# Altium project Fan Controller.PrjPcb
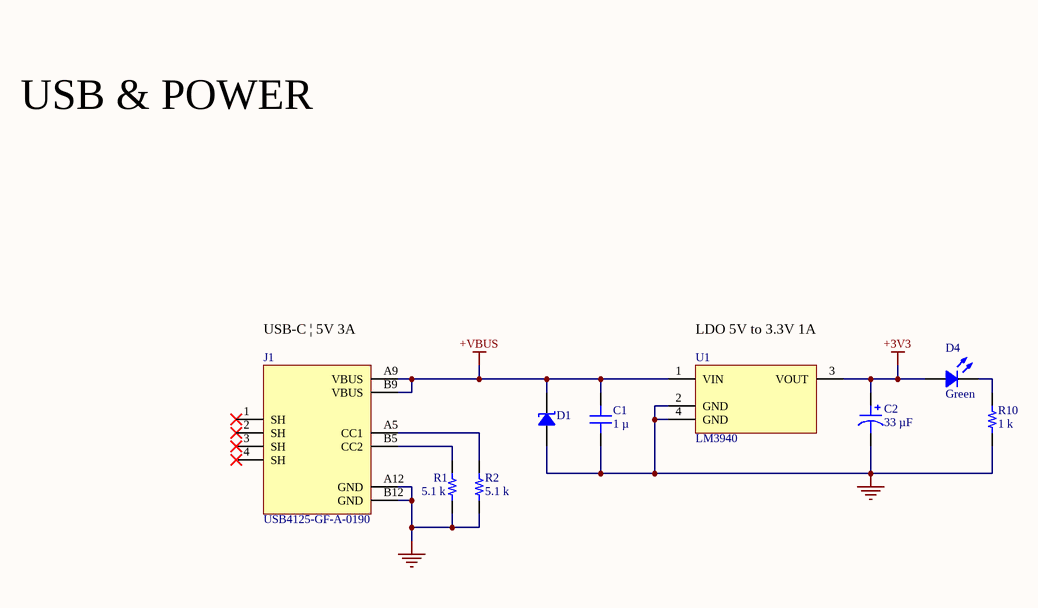
[diagram p0: USB.SchDoc]
3 sheets, 32 parts. Net scope: global (net labels, ports and power ports of the same name join across sheets).
Board file: CYCLONE.PcbDoc
Sheets:
  USB.SchDoc
  MCU.SchDoc
  PERIPHERALS.SchDoc

## Sheet USB.SchDoc
size 254 x 177 mm; SheetNumber: 1; SheetTotal: 3

### Parts
C1  1 µ  [CAP 0603_1608]
C2  33 µF  [CAP POL 1411_3528]
D1  VTVS5V0ASMF-M3-08  [SMF DO-219AB]  (value not drawn)
D4  Green  [LED 0603_1608 GREEN]
J1  USB4125-GF-A-0190  [FP-USB4125-GF-A-0190-MFG]
R1  5.1 k  [RES 0603_1608]
R2  5.1 k  [RES 0603_1608]
R10  1 k  [RES 0603_1608]
U1  LM3940  [FP-DCY0004A-IPC_C]

### Nets
+3V3: C2.1 D4.1 U1.3(VOUT)
+VBUS: C1.2 D1.2 J1.A9(VBUS) J1.B9(VBUS) U1.1(VIN)
GND: C1.1 C2.2 D1.1 J1.A12(GND) J1.B12(GND) R1.1 R2.1 R10.2 U1.2(GND) U1.4(GND)
NetD4_2: D4.2 R10.1
NetJ1_A5: J1.A5(CC1) R2.2
NetJ1_B5: J1.B5(CC2) R1.2

Not connected (* = marked no-connect by the designer): J1 1(SH)* 2(SH)* 3(SH)* 4(SH)*

### Notes on the sheet
- USB & POWER
- (near J1) USB-C | 5V 3A
- (near U1) LDO 5V to 3.3V 1A

### Library data of the parts
C1 = C0603C105K4RACAUTO: CAP CER 1UF 16V X7R 0603; manufacturer: KEMET; Capacitance: 1 µF; Tolerance: ±10%; Part Number: C0603C105K4RACAUTO; Value: 1 µ; Applications: Automotive, Bypass, Decoupling; componentlink1description: Datasheet; componentlink1url: https://api.kemet.com/component-edge/download/datasheet/C0603C105K4RACAUTO.pdf; componentlink2description: DigiKey Link; componentlink2url: https://www.digikey.com/en/products/detail/kemet/C0603C105K4RACAUTO/8635831; Device Package: 0603 (1608 Metric); lastupdated: 2/9/2024 8:10:30 PM; Lifecycle Status: Active; Minimum Order: 1; Mounting Type: Surface Mount, MLCC; Operating Temperature: -55°C ~ 125°C; Package / Case: 0603 (1608 Metric); packaging: TapeAndReel; partid: 2179; Part Status: Active; price: 0.01; Ratings: AEC-Q200; series: SMD Auto X7R; Size / Dimension: 0.063" L x 0.031" W (1.60mm x 0.80mm); Supplier 1: DigiKey; Supplier Part Number 1: 399-17704-1-ND; Temperature Coefficient: X7R; Thickness (Max): 0.037" (0.95mm); Voltage - Rated: 16V
C2 = T495B336M016ATE350: CAP TANT 33UF 20% 16V 1411; manufacturer: KEMET; Manufacturer Size Code: B; ESR (Equivalent Series Resistance): 350mOhm @ 100kHz; Lifetime @ Temp.: 2000 Hrs @ 125°C; Type: Molded; Part Number: T495B336M016ATE350; Value: 33 µF; Capacitance: 33 µF; componentlink1description: Datasheet; componentlink1url: https://api.kemet.com/component-edge/download/datasheet/T495B336M016ATE350.pdf; componentlink2description: DigiKey Link; componentlink2url: https://www.digikey.com/en/products/detail/kemet/T495B336M016ATE350/9642234; Device Package: 1411 (3528 Metric); Features: General Purpose; Height - Seated (Max): 0.083" (2.10mm); lastupdated: 3/11/2024 7:26:10 AM; Lifecycle Status: Active; Minimum Order: 1; Mounting Type: Surface Mount; Operating Temperature: -55°C ~ 125°C; Package / Case: 1411 (3528 Metric); packaging: TapeAndReel; partid: 33; Part Status: Active; price: 0.64; series: T495; Size / Dimension: 0.138" L x 0.110" W (3.50mm x 2.80mm); Supplier 1: DigiKey; Supplier Part Number 1: 399-18820-1-ND; Tolerance: ±20%; Voltage - Rated: 16 V
D1 = VTVS5V0ASMF-M3-08: TVS DIODE 5V 8.9V DO219AB; Manufacturer: Vishay Semiconductor Diodes Division; Capacitance @ Frequency: 2095pF @ 1MHz; Current - Peak Pulse (10/1000µs): 42.95A; Power Line Protection: No; Power - Peak Pulse: 400W; Type: Zener; Unidirectional Channels: 1; Voltage - Breakdown (Min): 6.4V; Part Number: VTVS5V0ASMF-M3-08; Applications: General Purpose; ComponentLink1Description: Datasheet; ComponentLink1URL: http://www.vishay.com/docs/85891/vtvs3v3asmf.pdf; ComponentLink2Description: DigiKey Link; ComponentLink2URL: http://digikey.com/product-detail/en/vishay-semiconductor-diodes-division/VTVS5V0ASMF-M3-08/VTVS5V0ASMF-M3-08GICT-ND/7056003; LastUpdated: 3/11/2024 8:09:28 AM; Lifecycle Status: Active; Minimum Order: 1; Mounting Type: Surface Mount; Operating Temperature: -55°C ~ 175°C (TJ); Package / Case: DO-219AB; Packaging: TapeAndReel; PartId: 5492; Part Status: Active; Price: 0.11; Series: TransZorb®; Supplier 1: DigiKey; Supplier Part Number 1: VTVS5V0ASMF-M3-08GICT-ND; Supplier Device Package: DO-219AB (SMF); Voltage - Clamping (Max) @ Ipp: 8.9V; Voltage - Reverse Standoff (Typ): 5V
D4 = SML-LXFP0603SUGCTR: LED GREEN CLEAR SMD; Manufacturer: Lumex Opto/Components Inc.; Configuration: Standard; Current - Test: 5mA; Lens Color: Colorless; Lens Size: 1.60mm x 0.80mm; Lens Style: Rectangle with Flat Top; Millicandela Rating: 13mcd; Viewing Angle: 130°; Voltage - Forward (Vf) (Typ): 2V; Wavelength - Peak: 574nm; Part Number: SML-LXFP0603SUGCTR; Color: Green; ComponentLink1Description: Datasheet; ComponentLink1URL: https://www.lumex.com/content/files/ProductAttachment/SML-LXFP0603SUGCTR.pdf; ComponentLink2Description: DigiKey Link; ComponentLink2URL: https://www.digikey.com/en/products/detail/lumex-opto-components-inc/SML-LXFP0603SUGCTR/4496766; Device Package: 0603 (1608 Metric); Height (Max): 0.20mm; LastUpdated: 3/11/2024 7:51:11 AM; Lens Transparency: Clear; Lifecycle Status: Active; Minimum Order: 1; Mounting Type: Surface Mount; Package / Case: 0603 (1608 Metric); Packaging: TapeAndReel; PartId: 589; Part Status: Active; Price: 0.07; Series: -; Size / Dimension: 1.60mm L x 0.80mm W; Supplier 1: DigiKey; Supplier Part Number 1: 67-2222-1-ND; Supplier Device Package: SMD; Value: Green
J1 = CMP-002-00081-2: USB-C (USB TYPE-C) Receptacle Connector 24 (6+18 Dummy) Position Surface Mount, Right Angle; Through Hole; Max Current Rating: 3A; Voltage Rating: 20V; Min Operating Temperature: -30°C; Pins: 24 (6+18 Dummy); Max Operating Temperature: 85°C; Gender: Receptacle; Connector Type: USB-C (USB TYPE-C); Manufacturer Part #: USB4125-GF-A; Mounting Technology: Surface Mount, Right Angle; Through Hole
R1 R2 = RMCF0603JG5K10: RES 5.1K OHM 5% 1/10W 0603; Manufacturer: Stackpole Electronics Inc; Power (Watts): 0.1W, 1/10W; Resistance: 5.1 kOhms; Temperature Coefficient: ±200ppm/°C; Part Number: RMCF0603JG5K10; Value: 5.1 k; ComponentLink1Description: Datasheet; ComponentLink1URL: https://www.seielect.com/catalog/sei-packaging.pdf; ComponentLink2Description: DigiKey Link; ComponentLink2URL: https://www.digikey.com/en/products/detail/stackpole-electronics-inc/RMCF0603JG5K10/1712287; Composition: Thick Film; Device Package: 0603 (1608 Metric); Features: Automotive AEC-Q200; Height - Seated (Max): 0.022" (0.55mm); LastUpdated: 2/9/2024 8:43:35 PM; Lifecycle Status: Active; Minimum Order: 1; Number of Terminations: 2; Operating Temperature: -55°C ~ 155°C; Package / Case: 0603 (1608 Metric); Packaging: CutTape; PartId: 5180; Part Status: Active; Price: 0.01; Ratings: AEC-Q200; Series: RMCF; Size / Dimension: 0.061" L x 0.031" W (1.55mm x 0.80mm); Supplier 1: DigiKey; Supplier Part Number 1: 738-RMCF0603JG5K10CT-ND; Supplier Device Package: 0603; Tolerance: ±5%
R10 = CPF0603B1K0E: RES SMD 1K OHM 0.1% 1/16W 0603; Manufacturer: TE Connectivity Passive Product; Power (Watts): 0.063W, 1/16W; Resistance: 1 kOhms; Temperature Coefficient: ±25ppm/°C; Part Number: CPF0603B1K0E; Value: 1 k; ComponentLink1Description: Datasheet; ComponentLink1URL: https://www.te.com/commerce/DocumentDelivery/DDEController?Action=srchrtrv&DocNm=1773200&DocType=DS&DocLang=English; ComponentLink2Description: DigiKey Link; ComponentLink2URL: https://www.digikey.com/en/products/detail/te-connectivity-passive-product/CPF0603B1K0E/2390473; Composition: Thin Film; Device Package: 0603 (1608 Metric); Height - Seated (Max): 0.022" (0.55mm); LastUpdated: 2/9/2024 8:43:37 PM; Lifecycle Status: Active; Minimum Order: 1; Number of Terminations: 2; Operating Temperature: -55°C ~ 155°C; Package / Case: 0603 (1608 Metric); Packaging: TapeAndReel; PartId: 4877; Part Status: Active; Price: 0.09; Series: CPF, Neohm; Size / Dimension: 0.061" L x 0.031" W (1.55mm x 0.80mm); Supplier 1: DigiKey; Supplier Part Number 1: A119887CT-ND; Supplier Device Package: 0603; Tolerance: ±0.1%
U1 = CMP-019-00049-4: IC REG LDO 3.3V 1A SOT223

## Sheet MCU.SchDoc
size 254 x 177 mm; SheetNumber: 2; SheetTotal: 3
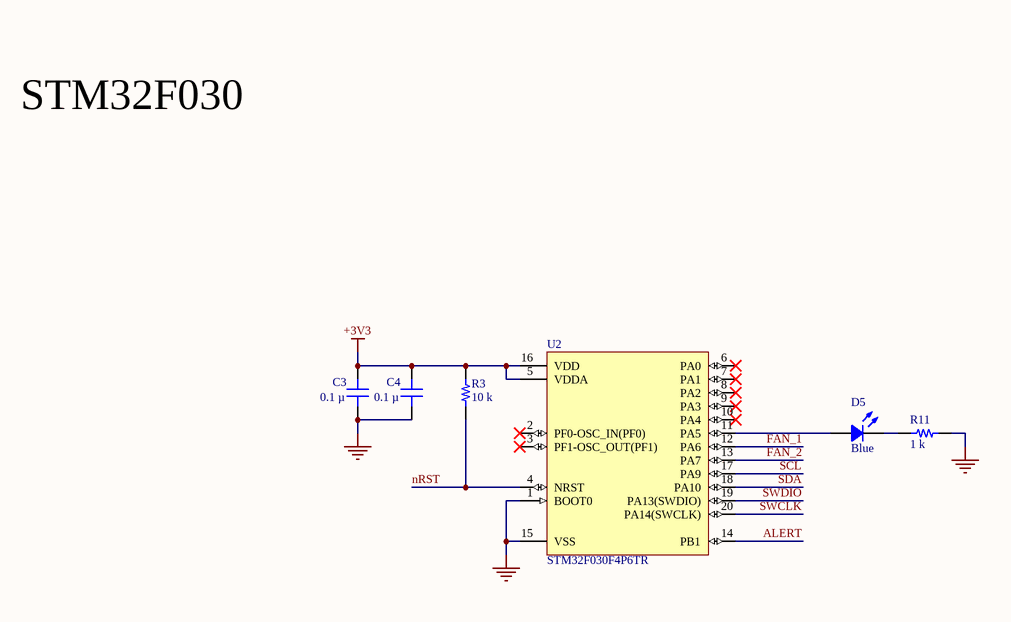
[diagram p1: MCU.SchDoc]

### Parts
C3  0.1 µ  [CAP 0603_1608]
C4  0.1 µ  [CAP 0603_1608]
D5  Blue  [LED 0603_1608 BLUE]
R3  10 k  [RES 0603_1608]
R11  1 k  [RES 0603_1608]
U2  STM32F030F4P6TR  [STM-TSSOP20_M]

### Nets
+3V3: C3.2 C4.2 R3.2 U2.5(VDDA) U2.16(VDD)
GND: C3.1 C4.1 R11.2 U2.1(BOOT0) U2.15(VSS)
ALERT: U2.14(PB1)
FAN_1: U2.12(PA6)
FAN_2: U2.13(PA7)
nRST: R3.1 U2.4(NRST)
SCL: U2.17(PA9)
SDA: U2.18(PA10)
SWCLK: U2.20(PA14(SWCLK))
SWDIO: U2.19(PA13(SWDIO))
NetD5_1: D5.1 U2.11(PA5)
NetD5_2: D5.2 R11.1

Not connected (* = marked no-connect by the designer): U2 2(PF0-OSC_IN(PF0))* 3(PF1-OSC_OUT(PF1))* 6(PA0)* 7(PA1)* 8(PA2)* 9(PA3)* 10(PA4)*

### Notes on the sheet
- STM32F030

### Library data of the parts
C3 C4 = C0603C104K5RAC7411: CAP CER 0.1UF 50V X7R 0603; manufacturer: KEMET; Capacitance: 0.1 µF; Tolerance: ±10%; Part Number: C0603C104K5RAC7411; Value: 0.1 µ; Applications: Bypass, Decoupling; componentlink1description: Datasheet; componentlink1url: https://api.kemet.com/component-edge/download/datasheet/C0603C104K5RAC7411.pdf; componentlink2description: DigiKey Link; componentlink2url: https://www.digikey.com/en/products/detail/kemet/C0603C104K5RAC7411/3317013; Device Package: 0603 (1608 Metric); lastupdated: 2/9/2024 8:10:30 PM; Lifecycle Status: Active; Minimum Order: 1; Mounting Type: Surface Mount, MLCC; Operating Temperature: -55°C ~ 125°C; Package / Case: 0603 (1608 Metric); packaging: TapeAndReel; partid: 2233; Part Status: Active; price: 0.01; series: SMD Comm X7R; Size / Dimension: 0.063" L x 0.031" W (1.60mm x 0.80mm); Supplier 1: DigiKey; Supplier Part Number 1: 399-C0603C104K5RAC7411CT-ND; Temperature Coefficient: X7R; Thickness (Max): 0.035" (0.90mm); Voltage - Rated: 50V
D5 = LTST-C190TBKT: LED BLUE CLEAR CHIP SMD; Manufacturer: Lite-On Inc.; Configuration: Standard; Current - Test: 20mA; Lens Color: Colorless; Lens Size: 1.10mm x 0.80mm; Lens Style: Rectangle with Flat Top; Millicandela Rating: 104mcd; Viewing Angle: 130°; Voltage - Forward (Vf) (Typ): 3.3V; Wavelength - Dominant: 470nm; Wavelength - Peak: 468nm; Part Number: LTST-C190TBKT; Color: Blue; ComponentLink1Description: Datasheet; ComponentLink1URL: http://optoelectronics.liteon.com/upload/download/DS-22-99-0224/LTST-C190TBKT.PDF; ComponentLink2Description: DigiKey Link; ComponentLink2URL: http://digikey.com/product-detail/en/lite-on-inc/LTST-C190TBKT/160-1646-1-ND/573586; Device Package: 0603 (1608 Metric); Height (Max): 0.90mm; LastUpdated: 3/11/2024 7:50:10 AM; Lens Transparency: Clear; Lifecycle Status: Active; Minimum Order: 1; Mounting Type: Surface Mount; Package / Case: 0603 (1608 Metric); Packaging: TapeAndReel; PartId: 831; Part Status: Active; Price: 0.08; Series: -; Size / Dimension: 1.60mm L x 0.80mm W; Supplier 1: DigiKey; Supplier Part Number 1: 160-1646-1-ND; Supplier Device Package: Chip LED; Value: Blue
R3 = RNCS0603BKE10K0: RES 10K OHM 0.1% 1/16W 0603; Manufacturer: Stackpole Electronics Inc; Power (Watts): 0.063W, 1/16W; Resistance: 10 kOhms; Temperature Coefficient: ±25ppm/°C; Part Number: RNCS0603BKE10K0; Value: 10 k; ComponentLink1Description: Datasheet; ComponentLink1URL: https://www.seielect.com/catalog/sei-rncs_rnch.pdf; ComponentLink2Description: DigiKey Link; ComponentLink2URL: https://www.digikey.com/en/products/detail/stackpole-electronics-inc/RNCS0603BKE10K0/1708836; Composition: Thin Film; Device Package: 0603 (1608 Metric); Features: Anti-Corrosive, Automotive AEC-Q200, Moisture Resistant; Height - Seated (Max): 0.022" (0.55mm); LastUpdated: 2/9/2024 8:43:37 PM; Lifecycle Status: Active; Minimum Order: 1; Number of Terminations: 2; Operating Temperature: -55°C ~ 155°C; Package / Case: 0603 (1608 Metric); Packaging: TapeAndReel; PartId: 4838; Part Status: Active; Price: 0.06; Ratings: AEC-Q200; Series: RNCS; Size / Dimension: 0.061" L x 0.031" W (1.55mm x 0.80mm); Supplier 1: DigiKey; Supplier Part Number 1: RNCS0603BKE10K0CT-ND; Supplier Device Package: 0603; Tolerance: ±0.1%
R11 = CPF0603B1K0E: as R10 on sheet USB; Part Number: CPF0603B1K0E; Value: 1 k; ComponentLink1Description: Datasheet; ComponentLink1URL: https://www.te.com/commerce/DocumentDelivery/DDEController?Action=srchrtrv&DocNm=1773200&DocType=DS&DocLang=English; ComponentLink2Description: DigiKey Link; ComponentLink2URL: https://www.digikey.com/en/products/detail/te-connectivity-passive-product/CPF0603B1K0E/2390473; Composition: Thin Film; Device Package: 0603 (1608 Metric); Height - Seated (Max): 0.022" (0.55mm); LastUpdated: 2/9/2024 8:43:37 PM; Lifecycle Status: Active; Minimum Order: 1; Number of Terminations: 2; Operating Temperature: -55°C ~ 155°C; Package / Case: 0603 (1608 Metric); Packaging: TapeAndReel; PartId: 4877; Part Status: Active; Price: 0.09; Series: CPF, Neohm; Size / Dimension: 0.061" L x 0.031" W (1.55mm x 0.80mm); Supplier 1: DigiKey; Supplier Part Number 1: A119887CT-ND; Supplier Device Package: 0603; Tolerance: ±0.1%
U2 = CMP-031-00009-3: RISC Microcontroller, 32-Bit, FLASH, CORTEX-M0 CPU, 48MHz, CMOS, PDSO20; Min Supply Voltage: 2.4V; Max Supply Voltage: 3.6V; Case/Package: TSSOP; Min Operating Temperature: -40°C; Pins: 20; RoHS Compliant: Yes; Max Operating Temperature: 85°C

## Sheet PERIPHERALS.SchDoc: dfl
size 254 x 177 mm; SheetNumber: 3; SheetTotal: 3
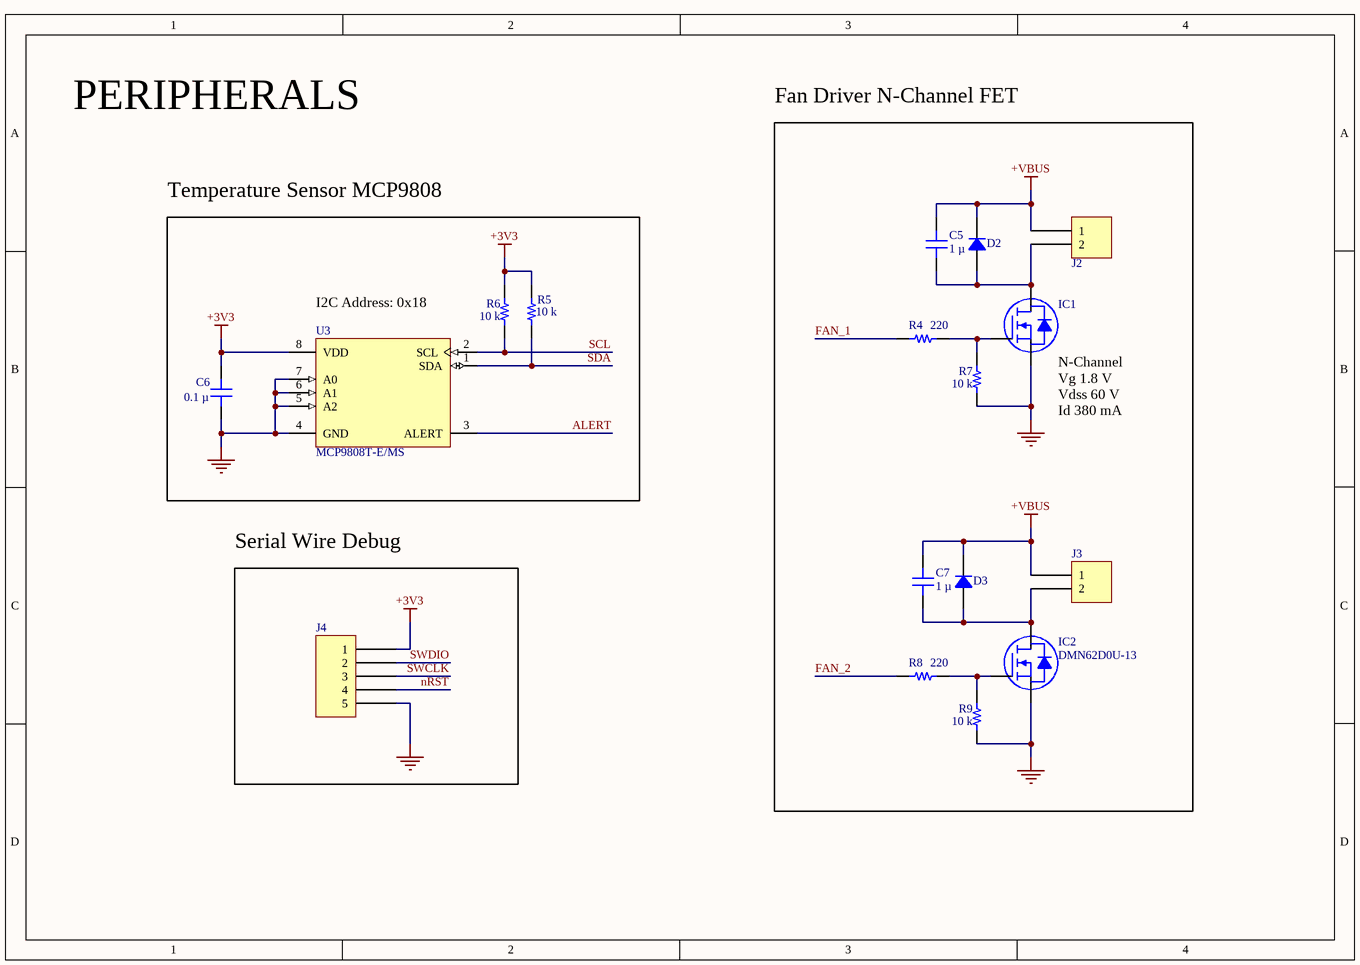
[diagram p2: PERIPHERALS.SchDoc]

### Parts
C5  1 µ  [CAP 0603_1608]
C6  0.1 µ  [CAP 0603_1608]
C7  1 µ  [CAP 0603_1608]
D2  US1DWF-7  [SOD123F]  (value not drawn)
D3  US1DWF-7  [SOD123F]  (value not drawn)
IC1  DMN62D0U-13  [DIODES SOT-23-3]  (value not drawn)
IC2  DMN62D0U-13  [DIODES SOT-23-3]
J2  S2B-PH-SM4-TB(LF)(SN)  [JST S2B-PH-SM4-TB]  (value not drawn)
J3  S2B-PH-SM4-TB(LF)(SN)  [JST S2B-PH-SM4-TB]  (value not drawn)
J4  NPPN051BFCN-RC  [SULLINS NPPN051BFCN]  (value not drawn)
R4  220  [RES 0603_1608]
R5  10 k  [RES 0603_1608]
R6  10 k  [RES 0603_1608]
R7  10 k  [RES 0603_1608]
R8  220  [RES 0603_1608]
R9  10 k  [RES 0603_1608]
U3  MCP9808T-E/MS  [FP-C04-111-MFG]

### Blocks framed on the sheet
Fan Driver N-Channel FET: C5 C7 D2 D3 IC1 IC2 J2 J3 R4 R7-R9
Temperature Sensor MCP9808: C6 R5 R6 U3
Serial Wire Debug: J4

### Nets
+3V3: C6.2 J4.1 R5.2 R6.2 U3.8(VDD)
+VBUS: C5.2 C7.2 D2.2 D3.2 J2.1 J3.1
GND: C6.1 IC1.2(S) IC2.2(S) J4.5 R7.1 R9.1 U3.4(GND) U3.5(A2) U3.6(A1) U3.7(A0)
ALERT: U3.3(ALERT)
FAN_1: R4.1
FAN_2: R8.1
nRST: J4.4
SCL: R6.1 U3.2(SCL)
SDA: R5.1 U3.1(SDA)
SWCLK: J4.3
SWDIO: J4.2
NetC5_1: C5.1 D2.1 IC1.3(D) J2.2
NetC7_1: C7.1 D3.1 IC2.3(D) J3.2
NetIC1_1: IC1.1(G) R4.2 R7.2
NetIC2_1: IC2.1(G) R8.2 R9.2

### Notes on the sheet
- PERIPHERALS
- (near U3) I2C Address: 0x18
- (near IC1) N-Channel
  Vg 1.8 V
  Vdss 60 V
  Id 380 mA

### Library data of the parts
C5 C7 = C0603C105K4RACAUTO: as C1 on sheet USB; Part Number: C0603C105K4RACAUTO; Value: 1 µ; Applications: Automotive, Bypass, Decoupling; componentlink1description: Datasheet; componentlink1url: https://api.kemet.com/component-edge/download/datasheet/C0603C105K4RACAUTO.pdf; componentlink2description: DigiKey Link; componentlink2url: https://www.digikey.com/en/products/detail/kemet/C0603C105K4RACAUTO/8635831; Device Package: 0603 (1608 Metric); lastupdated: 2/9/2024 8:10:30 PM; Lifecycle Status: Active; Minimum Order: 1; Mounting Type: Surface Mount, MLCC; Operating Temperature: -55°C ~ 125°C; Package / Case: 0603 (1608 Metric); packaging: TapeAndReel; partid: 2179; Part Status: Active; price: 0.01; Ratings: AEC-Q200; series: SMD Auto X7R; Size / Dimension: 0.063" L x 0.031" W (1.60mm x 0.80mm); Supplier 1: DigiKey; Supplier Part Number 1: 399-17704-1-ND; Temperature Coefficient: X7R; Thickness (Max): 0.037" (0.95mm); Voltage - Rated: 16V
C6 = C0603C104K5RAC7411: as C3 on sheet MCU; Part Number: C0603C104K5RAC7411; Value: 0.1 µ; Applications: Bypass, Decoupling; componentlink1description: Datasheet; componentlink1url: https://api.kemet.com/component-edge/download/datasheet/C0603C104K5RAC7411.pdf; componentlink2description: DigiKey Link; componentlink2url: https://www.digikey.com/en/products/detail/kemet/C0603C104K5RAC7411/3317013; Device Package: 0603 (1608 Metric); lastupdated: 2/9/2024 8:10:30 PM; Lifecycle Status: Active; Minimum Order: 1; Mounting Type: Surface Mount, MLCC; Operating Temperature: -55°C ~ 125°C; Package / Case: 0603 (1608 Metric); packaging: TapeAndReel; partid: 2233; Part Status: Active; price: 0.01; series: SMD Comm X7R; Size / Dimension: 0.063" L x 0.031" W (1.60mm x 0.80mm); Supplier 1: DigiKey; Supplier Part Number 1: 399-C0603C104K5RAC7411CT-ND; Temperature Coefficient: X7R; Thickness (Max): 0.035" (0.90mm); Voltage - Rated: 50V
D2 D3 = US1DWF-7: DIODE GEN PURP 200V 1A SOD123F; Manufacturer: Diodes Incorporated; Capacitance @ Vr, F: 14pF @ 4V, 1MHz; Current - Reverse Leakage @ Vr: 5 µA @ 200 V; Diode Type: Standard; Reverse Recovery Time (trr): 35 ns; Speed: Fast Recovery =< 500ns, > 200mA (Io); Voltage - Forward (Vf) (Max) @ If: 950 mV @ 1 A; Part Number: US1DWF-7; ComponentLink1Description: Datasheet; ComponentLink1URL: https://www.diodes.com/assets/Datasheets/US1DWF.pdf; ComponentLink2Description: DigiKey Link; ComponentLink2URL: https://www.digikey.com/en/products/detail/diodes-incorporated/US1DWF-7/7422876; Current - Average Rectified (Io): 1A; LastUpdated: 3/11/2024 7:46:45 AM; Lifecycle Status: Active; Minimum Order: 1; Mounting Type: Surface Mount; Operating Temperature - Junction: -55°C ~ 150°C; Package / Case: SOD-123F; Packaging: TapeAndReel; PartId: 1114; Part Status: Active; Price: 0.10; Series: -; Supplier 1: DigiKey; Supplier Part Number 1: US1DWF-7DICT-ND; Supplier Device Package: SOD-123F; Voltage - DC Reverse (Vr) (Max): 200 V
IC1 IC2 = DMN62D0U-13: MOSFET N-CH 60V 380MA SOT23; Manufacturer: Diodes Incorporated; Current - Continuous Drain (Id) @ 25°C: 380mA (Ta); Drive Voltage (Max Rds On,  Min Rds On): 1.8V, 4.5V; FET Type: N-Channel; Gate Charge (Qg) (Max) @ Vgs: 0.5 nC @ 4.5 V; Input Capacitance (Ciss) (Max) @ Vds: 32 pF @ 30 V; Power Dissipation (Max): 380mW (Ta); Rds On (Max) @ Id, Vgs: 2Ohm @ 100mA, 4.5V; Vgs (Max): ±20V; Vgs(th) (Max) @ Id: 1V @ 250µA; Part Number: DMN62D0U-13; ComponentLink1Description: Datasheet; ComponentLink1URL: https://www.diodes.com/assets/Datasheets/DMN62D0U.pdf; ComponentLink2Description: DigiKey Link; ComponentLink2URL: https://www.digikey.com/en/products/detail/diodes-incorporated/DMN62D0U-13/5453123; Drain to Source Voltage (Vdss): 60 V; LastUpdated: 3/11/2024 8:04:06 AM; Lifecycle Status: Active; Minimum Order: 1; Mounting Type: Surface Mount; Operating Temperature: -55°C ~ 150°C (TJ); Package / Case: TO-236-3, SC-59, SOT-23-3; Packaging: TapeAndReel; Part Status: Active; Price: 0.03; Series: -; Supplier 1: DigiKey; Supplier Part Number 1: DMN62D0U-13DICT-ND; Supplier Device Package: SOT-23-3; Technology: MOSFET (Metal Oxide)
J2 J3 = S2B-PH-SM4-TB(LF)(SN): CONN HEADER SMD R/A 2POS 2MM; Manufacturer: JST Sales America Inc.; Contact Length - Mating: 0.130" (3.30mm); Current Rating (Amps): 2A; Material Flammability Rating: UL94 V-0; Number of Positions: 2; Number of Positions Loaded: All; Pitch - Mating: 0.079" (2.00mm); Shrouding: Shrouded - 4 Wall; Style: Board to Cable/Wire; Voltage Rating: 100V; Part Number: S2B-PH-SM4-TB(LF)(SN); ComponentLink1Description: Datasheet; ComponentLink1URL: http://www.jst-mfg.com/product/pdf/eng/ePH.pdf; ComponentLink2Description: DigiKey Link; ComponentLink2URL: http://digikey.com/product-detail/en/jst-sales-america-inc/S2B-PH-SM4-TB-LF-SN/455-1749-1-ND/926846; Connector Type: Header; Contact Finish - Mating: Tin; Contact Finish - Post: Tin; Contact Material: Copper Alloy; Contact Shape: Square; Contact Type: Male Pin; Fastening Type: Detent Lock; Features: Solder Retention; Insulation Color: Natural; Insulation Height: 0.217" (5.51mm); Insulation Material: Polyamide (PA6T), Nylon 6T; LastUpdated: 1/15/2020 3:45:11 AM; Lifecycle Status: Active; Minimum Order: 1; Mounting Type: Surface Mount, Right Angle; Number of Rows: 1; Operating Temperature: -25°C ~ 85°C; Packaging: TapeAndReel; PartId: 115; Part Status: Active; Price: 0.27; Series: PH; Supplier 1: DigiKey; Supplier Part Number 1: 455-1749-1-ND; Termination: Solder
J4 = NPPN051BFCN-RC: CONN HDR 5POS 0.079 GOLD PCB; Manufacturer: Sullins Connector Solutions; Connector Type: Header; Contact Length - Post: 0.094" (2.40mm); Current Rating (Amps): 2A; Material Flammability Rating: UL94 V-0; Number of Positions: 5; Number of Positions Loaded: All; Pitch - Mating: 0.079" (2.00mm); Style: Board to Board; Part Number: NPPN051BFCN-RC; ComponentLink1Description: Datasheet; ComponentLink1URL: https://drawings-pdf.s3.amazonaws.com/10483.pdf; ComponentLink2Description: DigiKey Link; ComponentLink2URL: https://www.digikey.com/en/products/detail/sullins-connector-solutions/NPPN051BFCN-RC/804807; Contact Finish - Mating: Gold; Contact Finish - Post: Gold; Contact Finish Thickness - Mating: Flash; Contact Type: Female Socket; Fastening Type: Push-Pull; Insulation Color: Black; Insulation Height: 0.173" (4.40mm); LastUpdated: 6/21/2022 2:43:08 PM; Lifecycle Status: Active; Minimum Order: 1; Mounting Type: Through Hole; Number of Rows: 1; Operating Temperature: -40°C ~ 105°C; Packaging: Tube; Part Status: Active; Price: 0.35; Series: -; Supplier 1: DigiKey; Supplier Part Number 1: S5751-05-ND; Termination: Solder
R4 R8 = ERA-3AED221V: RES SMD 220 OHM 0.5% 1/10W 0603; Manufacturer: Panasonic Electronic Components; Power (Watts): 0.1W, 1/10W; Resistance: 220 Ohms; Temperature Coefficient: ±25ppm/°C; Part Number: ERA-3AED221V; Value: 220; ComponentLink1Description: Datasheet; ComponentLink1URL: https://industrial.panasonic.com/cdbs/www-data/pdf/RDM0000/AOA0000C307.pdf; ComponentLink2Description: DigiKey Link; ComponentLink2URL: https://www.digikey.com/en/products/detail/panasonic-electronic-components/ERA-3AED221V/9373509; Composition: Thin Film; Device Package: 0603 (1608 Metric); Features: Automotive AEC-Q200; Height - Seated (Max): 0.022" (0.55mm); LastUpdated: 2/9/2024 8:43:36 PM; Lifecycle Status: Active; Minimum Order: 1; Number of Terminations: 2; Operating Temperature: -55°C ~ 155°C; Package / Case: 0603 (1608 Metric); Packaging: TapeAndReel; PartId: 4952; Part Status: Active; Price: 0.03; Ratings: AEC-Q200; Series: ERA-3A; Size / Dimension: 0.063" L x 0.031" W (1.60mm x 0.80mm); Supplier 1: DigiKey; Supplier Part Number 1: P123752CT-ND; Supplier Device Package: 0603; Tolerance: ±0.5%
R5-R7 R9 = RNCS0603BKE10K0: as R3 on sheet MCU; Part Number: RNCS0603BKE10K0; Value: 10 k; ComponentLink1Description: Datasheet; ComponentLink1URL: https://www.seielect.com/catalog/sei-rncs_rnch.pdf; ComponentLink2Description: DigiKey Link; ComponentLink2URL: https://www.digikey.com/en/products/detail/stackpole-electronics-inc/RNCS0603BKE10K0/1708836; Composition: Thin Film; Device Package: 0603 (1608 Metric); Features: Anti-Corrosive, Automotive AEC-Q200, Moisture Resistant; Height - Seated (Max): 0.022" (0.55mm); LastUpdated: 2/9/2024 8:43:37 PM; Lifecycle Status: Active; Minimum Order: 1; Number of Terminations: 2; Operating Temperature: -55°C ~ 155°C; Package / Case: 0603 (1608 Metric); Packaging: TapeAndReel; PartId: 4838; Part Status: Active; Price: 0.06; Ratings: AEC-Q200; Series: RNCS; Size / Dimension: 0.061" L x 0.031" W (1.55mm x 0.80mm); Supplier 1: DigiKey; Supplier Part Number 1: RNCS0603BKE10K0CT-ND; Supplier Device Package: 0603; Tolerance: ±0.1%
U3 = CMP-010-00026-1: Serial Switch/Digital Sensor, 16 Bit(s), 1Cel, Square, Surface Mount; Min Supply Voltage: 2.7V; Sensor Type: TEMPERATURE SENSOR,SWITCH/DIGITAL OUTPUT,SERIAL; Max Supply Voltage: 5.5V; Mounting Technology: Surface Mount; RoHS Compliant: Yes; Max Operating Temperature: 125°C; Min Operating Temperature: -40°C

## Nets that join several sheets
+3V3: USB (C2.1 D4.1 U1.3), MCU (5 pins), PERIPHERALS (5 pins)
+VBUS: USB (5 pins), PERIPHERALS (6 pins)
GND: USB (10 pins), MCU (5 pins), PERIPHERALS (10 pins)
ALERT: MCU (U2.14), PERIPHERALS (U3.3)
FAN_1: MCU (U2.12), PERIPHERALS (R4.1)
FAN_2: MCU (U2.13), PERIPHERALS (R8.1)
nRST: MCU (R3.1 U2.4), PERIPHERALS (J4.4)
SCL: MCU (U2.17), PERIPHERALS (R6.1 U3.2)
SDA: MCU (U2.18), PERIPHERALS (R5.1 U3.1)
SWCLK: MCU (U2.20), PERIPHERALS (J4.3)
SWDIO: MCU (U2.19), PERIPHERALS (J4.2)